# EAGLE design hs-32-spi (EAGLE 9.6.2)
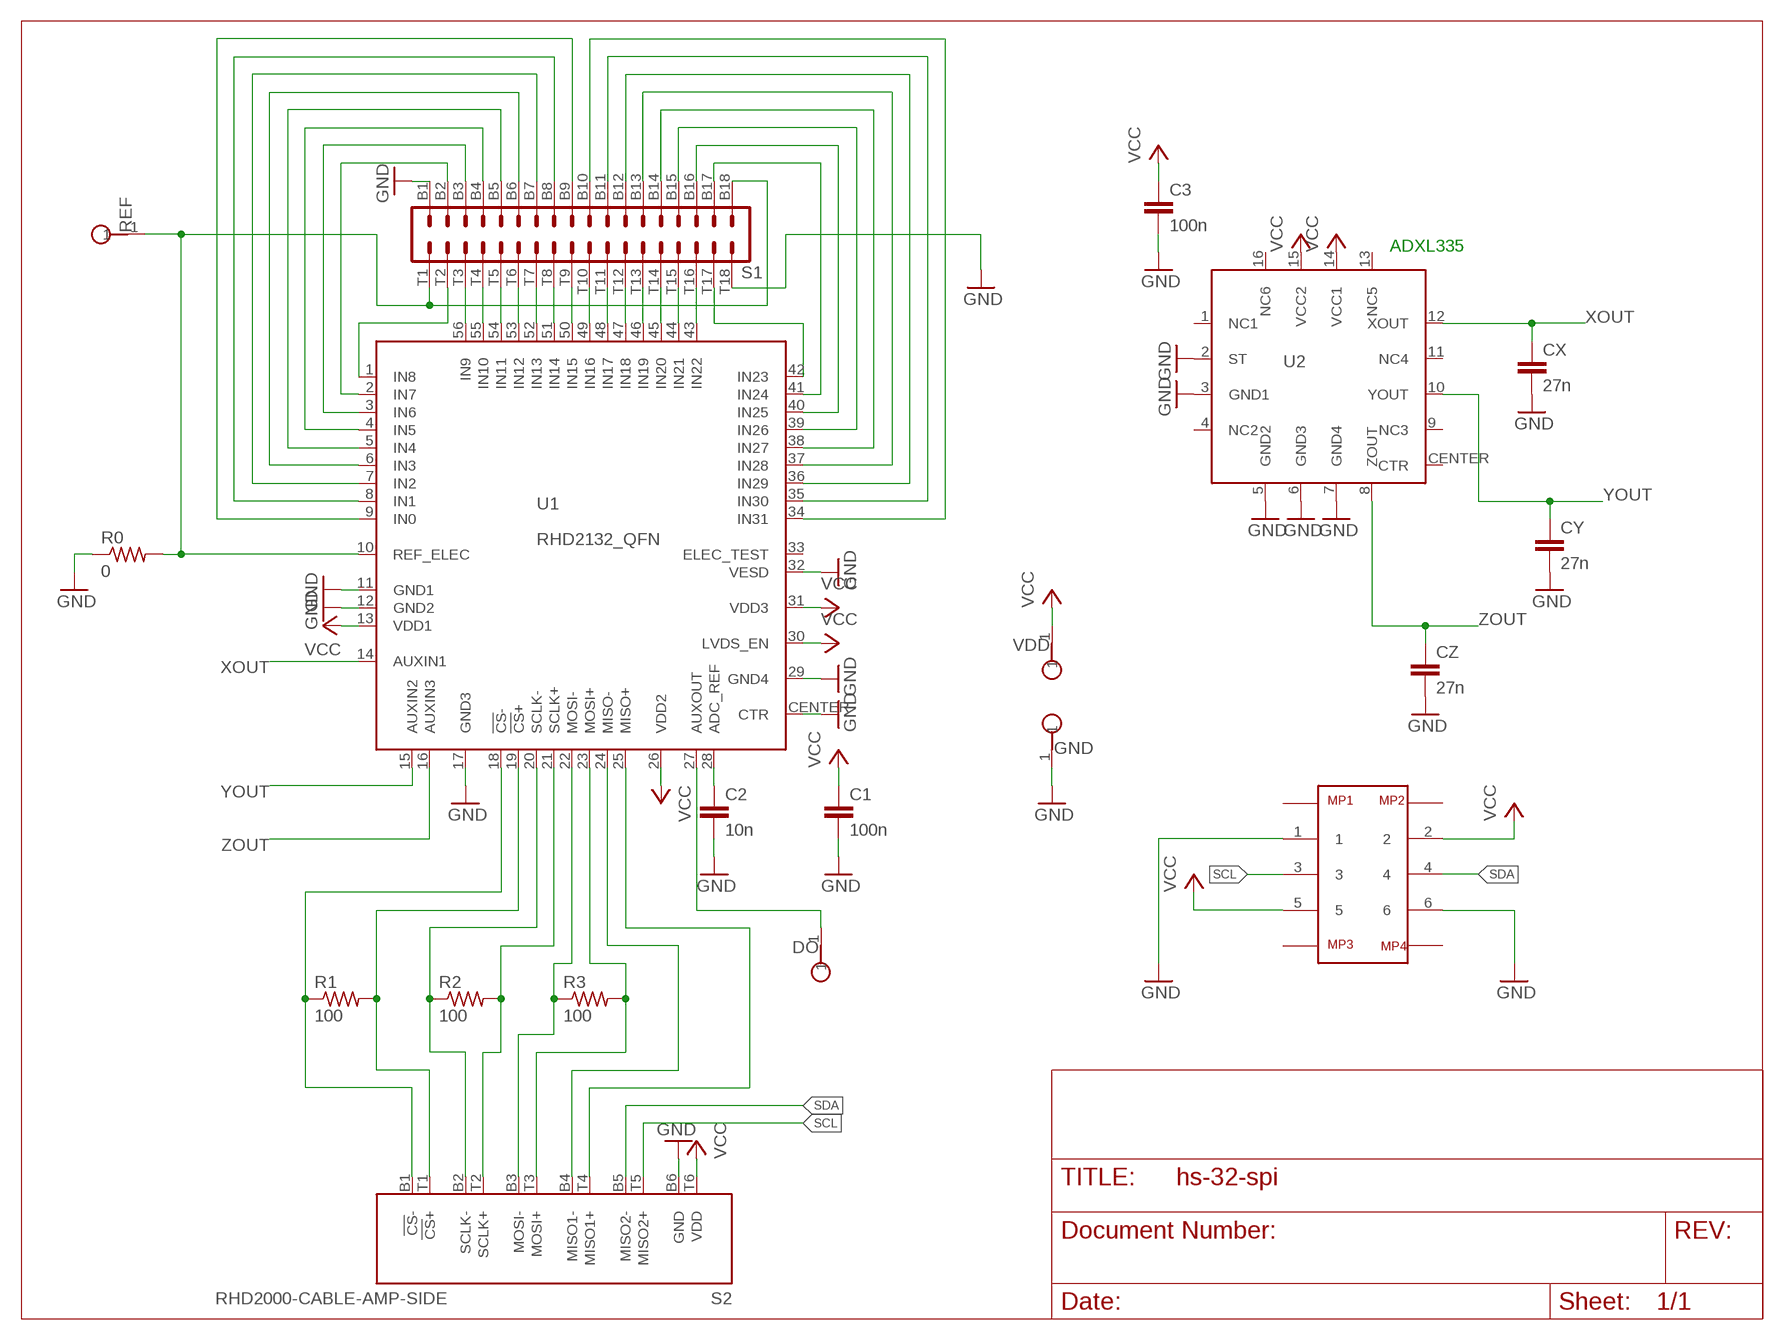
[diagram p0: schematic, sheet 1]

## Parts
C1  100n  C_0402  [0402]
C2  10n  C_0402  [0402]
C3  100n  C_0402  [0402]
CX  27n  C_0402  [0402]
CY  27n  C_0402  [0402]
CZ  27n  C_0402  [0402]
DO  TESTPOINT_SMALL  [TESTPOINT_SMALL]
GND  TESTPOINT_SMALL  [TESTPOINT_SMALL]
R0  0  R_0402  [0402]
R1  100  R_0201  [0201]
R2  100  R_0201  [0201]
R3  100  R_0201  [0201]
REF  TESTPOINT_SMALL  [TESTPOINT_SMALL]
S1  OMNETICS_A79025  [OMNETICS_A79025]
S2  RHD2000-CABLE-AMP-SIDE  [OMNETICS_PZN-12-AA]
U1  RHD2132_QFN  [QFN56_8_X_8_LARGE]
U2  ADXL335  [ADXL335]
U3  MOLEX_5050700622  [MOLEX_5050700622]
VDD  TESTPOINT_SMALL  [TESTPOINT_SMALL]

## Nets
GND: C1.2 C2.2 C3.2 CX.2 CY.2 CZ.2 GND.1 R0.1 S1.B1 S1.T18 S2.B6(GND) U1.11(GND1) U1.12(GND2) U1.17(GND3) U1.29(GND4) U1.32(VESD) U1.CENTER(CTR) U2.2(ST) U2.3(GND1) U2.5(GND2) U2.6(GND3) U2.7(GND4) U3.1 U3.6
N$1: R0.2 REF.1 S1.B18 S1.T1 U1.10(REF_ELEC)
N$2: S1.B3 U1.3(IN6)
N$3: S1.B2 U1.2(IN7)
N$4: S1.B4 U1.4(IN5)
N$5: S1.B5 U1.5(IN4)
N$6: S1.B6 U1.6(IN3)
N$7: S1.B7 U1.7(IN2)
N$8: S1.B8 U1.8(IN1)
N$9: S1.B9 U1.9(IN0)
N$10: S1.B10 U1.34(IN31)
N$11: R1.1 S2.B1(!CS!-) U1.18(!CS!-)
N$12: S1.B17 U1.41(IN24)
N$13: S1.B16 U1.40(IN25)
N$14: S1.B15 U1.39(IN26)
N$15: S1.B14 U1.38(IN27)
N$16: S1.B13 U1.37(IN28)
N$17: S1.B12 U1.36(IN29)
N$18: S1.B11 U1.35(IN30)
N$19: S1.T9 U1.50(IN15)
N$20: S1.T8 U1.51(IN14)
N$21: S1.T7 U1.52(IN13)
N$22: S1.T3 U1.56(IN9)
N$23: S1.T4 U1.55(IN10)
N$24: S1.T5 U1.54(IN11)
N$25: S1.T6 U1.53(IN12)
N$26: S1.T10 U1.49(IN16)
N$27: S1.T11 U1.48(IN17)
N$28: S1.T12 U1.47(IN18)
N$29: S1.T13 U1.46(IN19)
N$30: S1.T14 U1.45(IN20)
N$31: S1.T15 U1.44(IN21)
N$32: S1.T16 U1.43(IN22)
N$33: S1.T2 U1.1(IN8)
N$34: S1.T17 U1.42(IN23)
N$35: R1.2 S2.T1(!CS!+) U1.19(!CS!+)
N$36: R2.1 S2.B2(SCLK-) U1.20(SCLK-)
N$37: R2.2 S2.T2(SCLK+) U1.21(SCLK+)
N$38: R3.1 S2.B3(MOSI-) U1.22(MOSI-)
N$39: R3.2 S2.T3(MOSI+) U1.23(MOSI+)
N$40: S2.B4(MISO1-) U1.24(MISO-)
N$41: S2.T4(MISO1+) U1.25(MISO+)
N$42: C2.1 U1.28(ADC_REF)
N$43: DO.1 U1.27(AUXOUT)
SCL: S2.T5(MISO2+) U3.3
SDA: S2.B5(MISO2-) U3.4
VCC: C1.1 C3.1 S2.T6(VDD) U1.13(VDD1) U1.26(VDD2) U1.30(LVDS_EN) U1.31(VDD3) U2.14(VCC1) U2.15(VCC2) U3.2 U3.5 VDD.1
XOUT: CX.1 U1.14(AUXIN1) U2.12(XOUT)
YOUT: CY.1 U1.15(AUXIN2) U2.10(YOUT)
ZOUT: CZ.1 U1.16(AUXIN3) U2.8(ZOUT)
Unconnected: U1.33(ELEC_TEST) U2.1(NC1) U2.4(NC2) U2.9(NC3) U2.11(NC4) U2.13(NC5) U2.16(NC6) U2.CENTER(CTR) U3.MP1 U3.MP2 U3.MP3 U3.MP4

## Notes on the sheet
- ADXL335

## Library data of the parts
C1-C3 CX CY CZ = RHD2000_eval_board:C: Capacitor
DO GND REF VDD = RHD2000_eval_board:TESTPOINT: PCB Test Point
R0 R1-R3 = RHD2000_eval_board:R: Resistor
S1 = RHD2000:OMNETICS_A79025
S2 = RHD2000:RHD2000-CABLE-AMP-SIDE
U1 = RHD2000:RHD2132
U2 = harrison:ADXL335
U3 = Molex 5050700622:MOLEX_5050700622: Molex 5050700622

## Net classes
1 thick: width 1.016 mm
2 power: width 0.61 mm

## Board
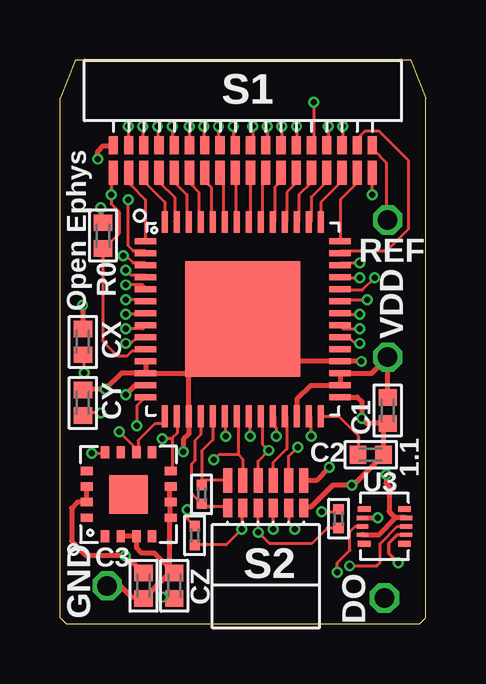
[diagram p1: board, top side]
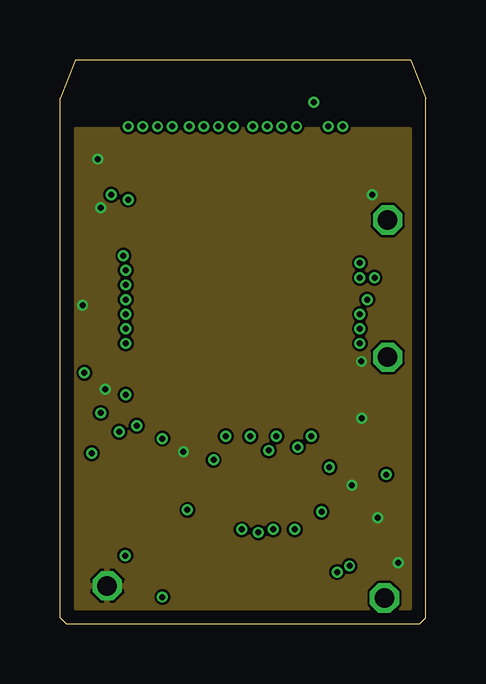
[diagram p2: board, inner layer Route2]
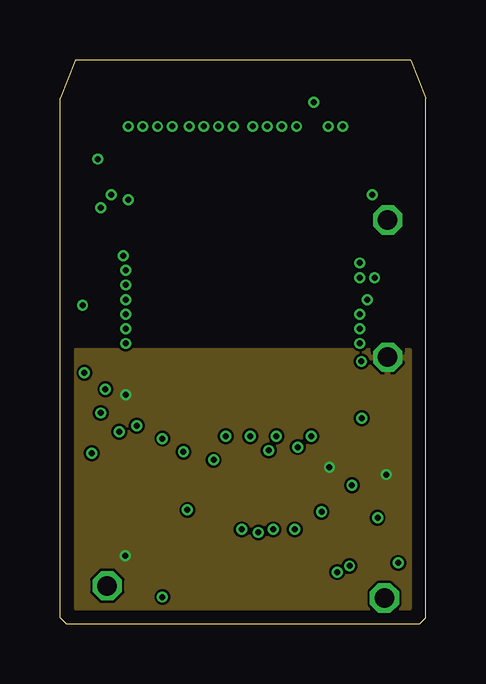
[diagram p3: board, inner layer Route3]
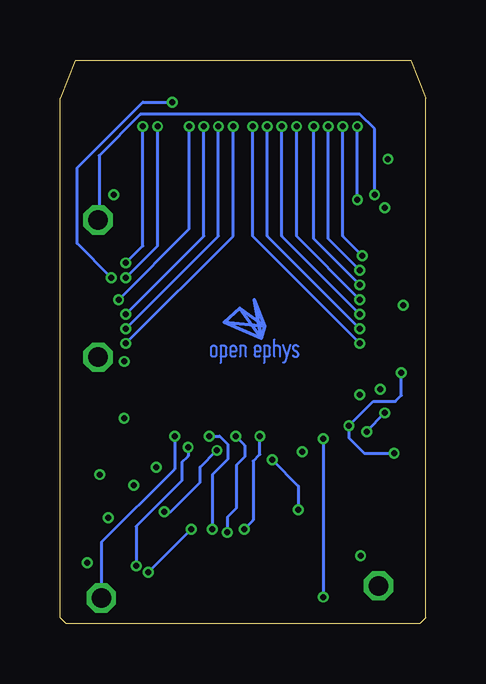
[diagram p4: board, bottom side, seen from below]

Size 15.24 x 23.5 mm. Coordinates in mm from the lower left corner, seen from the top.
Outline: 0,0.25 0,21.91 0.64,23.5 14.61,23.5 15.24,21.91 15.24,0.25 14.99,0 0.25,0 0,0.25
Copper layers (1*2+3*16): Top 0.035mm / dielectric 0.2mm / Route2 0.0175mm / dielectric 0.3mm / Route3 0.035mm / dielectric 0.2mm / Bottom 0.035mm
Design rules "seeed-studio-4-layer": minimum track width 0.09mm, minimum drill 0.2mm, track to track 4mil, track to pad 4mil, pad to pad 4mil, via to via 4mil, smd to smd 0mil, copper to edge 0.1mm, drill to drill 10mil, minimum pad ring 6mil, minimum via ring 4mil, stop-mask expansion 1mil, vias tented up to drill 100mil, thermal gap 0.1mm

### Footprints (pad centres in the part's own frame; a part is rotated, then mirrored left to right if it is on the bottom)
0402 = smd 0.686 x 0.762: 1 -0.533,0; 2 0.533,0
TESTPOINT_SMALL = drill 0.813 octagon: 1 0,0
0201 = smd 0.432 x 0.432: 1 -0.394,0; 2 0.394,0
OMNETICS_A79025 = smd 0.381 x 0.762: B1 -5.397,-1.016; B2 -4.763,-1.016; B3 -4.128,-1.016; B4 -3.493,-1.016; B5 -2.857,-1.016; B6 -2.223,-1.016; B7 -1.587,-1.016; B8 -0.953,-1.016; B9 -0.318,-1.016; B10 0.318,-1.016; B11 0.953,-1.016; B12 1.587,-1.016; B13 2.223,-1.016; B14 2.857,-1.016; B15 3.493,-1.016; B16 4.128,-1.016; B17 4.763,-1.016; B18 5.397,-1.016 | smd 0.381 x 1.016: T1 -5.397,-2.159; T2 -4.763,-2.159; T3 -4.128,-2.159; T4 -3.493,-2.159; T5 -2.857,-2.159; T6 -2.223,-2.159; T7 -1.587,-2.159; T8 -0.953,-2.159; T9 -0.318,-2.159; T10 0.318,-2.159; T11 0.953,-2.159; T12 1.587,-2.159; T13 2.223,-2.159; T14 2.857,-2.159; T15 3.493,-2.159; T16 4.128,-2.159; T17 4.763,-2.159; T18 5.397,-2.159
OMNETICS_PZN-12-AA = smd 0.381 x 0.762: B1 1.587,-1.016; B2 0.953,-1.016; B3 0.318,-1.016; B4 -0.318,-1.016; B5 -0.953,-1.016; B6 -1.587,-1.016 | smd 0.381 x 1.016: T1 1.587,-2.159; T2 0.953,-2.159; T3 0.318,-2.159; T4 -0.318,-2.159; T5 -0.953,-2.159; T6 -1.587,-2.159
QFN56_8_X_8_LARGE = smd 0.9 x 0.25: 1 -4.05,3.25; 2 -4.05,2.75; 3 -4.05,2.25; 4 -4.05,1.75; 5 -4.05,1.25; 6 -4.05,0.75; 7 -4.05,0.25; 8 -4.05,-0.25; 9 -4.05,-0.75; 10 -4.05,-1.25; 11 -4.05,-1.75; 12 -4.05,-2.25; 13 -4.05,-2.75; 14 -4.05,-3.25; 29 4.05,-3.25; 30 4.05,-2.75; 31 4.05,-2.25; 32 4.05,-1.75; 33 4.05,-1.25; 34 4.05,-0.75; 35 4.05,-0.25; 36 4.05,0.25; 37 4.05,0.75; 38 4.05,1.25; 39 4.05,1.75; 40 4.05,2.25; 41 4.05,2.75; 42 4.05,3.25 | smd 0.25 x 0.9: 15 -3.25,-4.05; 16 -2.75,-4.05; 17 -2.25,-4.05; 18 -1.75,-4.05; 19 -1.25,-4.05; 20 -0.75,-4.05; 21 -0.25,-4.05; 22 0.25,-4.05; 23 0.75,-4.05; 24 1.25,-4.05; 25 1.75,-4.05; 26 2.25,-4.05; 27 2.75,-4.05; 28 3.25,-4.05; 43 3.25,4.05; 44 2.75,4.05; 45 2.25,4.05; 46 1.75,4.05; 47 1.25,4.05; 48 0.75,4.05; 49 0.25,4.05; 50 -0.25,4.05; 51 -0.75,4.05; 52 -1.25,4.05; 53 -1.75,4.05; 54 -2.25,4.05; 55 -2.75,4.05; 56 -3.25,4.05 | smd 4.8 x 4.8: CENTER 0,0
ADXL335 = smd 0.5 x 0.35: 1 -1.75,0.975; 2 -1.75,0.325; 3 -1.75,-0.325; 4 -1.75,-0.975; 9 1.75,-0.975; 10 1.75,-0.325; 11 1.75,0.325; 12 1.75,0.975 | smd 0.35 x 0.5: 5 -0.975,-1.75; 6 -0.325,-1.75; 7 0.325,-1.75; 8 0.975,-1.75; 13 0.975,1.75; 14 0.325,1.75; 15 -0.325,1.75; 16 -0.975,1.75 | smd 1.6 x 1.6: CENTER 0,0
MOLEX_5050700622 = smd 0.18 x 0.485: 1 -0.35,-0.907; 2 -0.35,0.907; 3 0,-0.907; 4 0,0.907; 5 0.35,-0.907; 6 0.35,0.907 | smd 0.23 x 0.535: MP1 -0.725,-0.835; MP2 -0.725,0.835; MP3 0.725,-0.835; MP4 0.725,0.835

### Placement (x,y rotation side)
C1  13.65,8.89 270 top
C2  12.95,7.05 0 top
C3  3.48,1.59 270 top
CX  0.95,11.75 90 top
CY  0.95,9.21 90 top
CZ  4.76,1.59 90 top
DO  13.52,1.08 0 top
GND  1.97,1.59 0 top
R0  1.79,16.18 270 top
R1  5.91,5.4 90 top
R2  5.61,3.68 90 top
R3  11.61,4.38 90 top
REF  13.65,16.83 90 top
S1  7.62,20.95 0 top
S2  8.57,3.81 180 top
U1  7.62,12.7 0 top
U2  2.86,5.4 90 top
U3  13.52,4.06 90 top
VDD  13.65,11.11 0 top
X  OE-LOGO_3.5X2.5  [OE-LOGO-3.5X2.5]  7.3,11.81 0 bottom

### Tracks (layer width: path | path; a pad name or v marks a point on that pad's centre or on a via)
GND  (via drill 0.25)
  Top 0.127: 9.35,10.97 7.81,12.51 U1.CENTER | 11.58,10.97 U1.32 | 2.13,19.91 S1.B1 | 1.02,9.75 CY.2 | CX.2 | 10.21,4.88 S2.B6 | 13.57,7.13 13.72,7.3 | 4.57,4.47 U2.5 4.57,4.37 | 4.57,4.98 U2.6 4.57,5.08 | 4.57,5.69 U2.7 | U2.2 | 3.15,3.66 U2.3 | 4.57,2.13 4.76,2.13 CZ.2 | 3.45,1.12 C3.2 3.49,1.05 | v13.01,17.88 13.01,18.8 S1.T18 | 1.67,16.71 R0.1
  Top 0.152: U3.1 14.05,3.71 13.7,3.37 13.7,2.93 v14.1,2.54
  Top 0.203: 9.35,10.97 11.58,10.97 | 10.21,4.88 10.46,4.88 11.37,5.78 v12.17,5.78 12.21,5.78 13.57,7.13 | 4.57,4.98 4.57,4.47 | 4.57,5.08 4.57,5.69 | 3.15,3.66 U2.2 | 4.57,4.37 4.57,2.13 3.49,1.05 | 3.45,1.12 2.98,1.12 2.52,1.59 GND.1 | U3.6 v13.23,4.41 v13.23,4.42 | v5.14,7.18 5.14,7.68 5.37,7.91 U1.17 5.37,10.54 | CZ.2 3.94,2.95 3.4,2.95 3.19,3.16 U2.3 | 5.37,10.54 5.37,10.7 7.18,12.51 7.81,12.51 | U1.12 5.28,10.45 5.37,10.54 | U1.12 2.56,10.45 v1.89,9.78 1.04,9.78 1.02,9.75 | v1.57,19.37 1.57,19.7 1.79,19.91 2.13,19.91 | v1.7,17.34 1.7,16.75 1.67,16.71 | CX.2 0.94,12.29 v0.94,13.27 | U1.29 12.39,9.45 12.57,9.27 v12.57,8.57 12.79,8.36 13.59,8.36 | C1.2 13.59,8.36 | U1.11 U1.12 | C2.2 13.49,8.26 13.59,8.36 | v12.56,10.94 11.69,10.94 U1.32
  pour Route2: 0.64,0.64 14.61,0.64 14.61,20.64 0.64,20.64
N$1  (via drill 0.25)
  Top 0.127: S1.B18 13.11,19.91 13.11,19.71 13.61,19.2 13.61,16.87 REF.1 | S1.T1 2.13,18.8 v2.13,17.88 2.13,17.5 2.49,17.14 2.49,16.28 2.06,15.85 1.99,15.85 R0.2 1.78,15.62 1.78,11.79 2.39,11.18 2.81,11.18 3.01,11.38 3.56,11.38 U1.10
  Bottom 0.127: v2.13,17.88 2.13,20.62 2.74,21.23 11.89,21.23 13.61,19.51 13.61,16.87 REF.1
N$2  (via drill 0.25)
  Top 0.127: v3.45,20.73 3.45,20.02 S1.B3 | v2.64,15.34 2.74,15.34 3.05,15.04 3.56,15.04 U1.3
  Bottom 0.127: v3.45,20.73 3.45,16.15 v2.64,15.34
N$3  (via drill 0.25)
  Top 0.127: v2.85,20.73 2.85,20.02 S1.B2 | v2.85,17.68 2.85,15.75 3.05,15.54 3.56,15.54 U1.2
  Bottom 0.127: v2.85,17.68 v2.85,20.73
N$4  (via drill 0.25)
  Top 0.127: v4.06,20.73 4.06,20.02 S1.B4 | v2.74,14.73 2.95,14.53 3.56,14.53 U1.4
  Bottom 0.127: v4.06,20.73 4.06,16.05 v2.74,14.73
N$5  (via drill 0.25)
  Top 0.127: v4.67,20.73 4.67,20.02 S1.B5 | v2.74,14.12 3.45,14.12 3.56,14.02 U1.5
  Bottom 0.127: v4.67,20.73 4.67,16.05 v2.74,14.12
N$6  (via drill 0.25)
  Top 0.127: v5.38,20.73 5.38,20.02 S1.B6 | v2.74,13.51 3.56,13.51 U1.6
  Bottom 0.127: v5.38,20.73 5.38,16.15 v2.74,13.51
N$7  (via drill 0.25)
  Top 0.127: v5.99,20.73 5.99,20.02 S1.B7 | v2.74,12.9 3.56,12.9 U1.7
  Bottom 0.127: v5.99,20.73 5.99,16.15 v2.74,12.9
N$8  (via drill 0.25)
  Top 0.127: v6.6,20.73 6.6,20.02 S1.B8 | v2.74,12.29 3.45,12.29 3.56,12.39 U1.8
  Bottom 0.127: v6.6,20.73 6.6,16.15 v2.74,12.29
N$9  (via drill 0.25)
  Top 0.127: v7.21,20.73 7.21,20.02 S1.B9 | v2.74,11.68 2.95,11.68 3.15,11.89 3.56,11.89 U1.9
  Bottom 0.127: v7.21,20.73 7.21,16.15 v2.74,11.68
N$10  (via drill 0.25)
  Top 0.127: v8.03,20.73 8.03,20.02 S1.B10 | v12.5,11.68 12.29,11.68 12.09,11.89 11.68,11.89 U1.34
  Bottom 0.127: v8.03,20.73 8.03,16.15 v12.5,11.68
N$11
  Top 0.127: S2.B1 6.96,4.88 5.94,4.88 R1.1 5.49,5.42 5.49,6.67 5.64,6.82 5.64,7.66 5.87,7.89 U1.18
N$12
  Top 0.127: S1.B17 12.39,20.02 12.39,20.22 12.7,20.52 13.31,20.52 14.53,19.3 14.53,16.46 13.61,15.54 11.68,15.54 U1.41
N$13  (via drill 0.25)
  Top 0.127: v11.79,20.73 11.79,20.02 S1.B16 | v12.5,15.04 11.68,15.04 U1.40
  Bottom 0.127: v11.79,20.73 11.79,15.75 v12.5,15.04
N$14  (via drill 0.25)
  Top 0.127: v11.18,20.73 11.18,20.02 S1.B15 | v12.5,14.43 11.68,14.43 U1.39
  Bottom 0.127: v11.18,20.73 11.18,15.75 v12.5,14.43
N$15  (via drill 0.25)
  Top 0.127: v10.57,21.74 10.57,20.02 S1.B14 | v13.11,14.43 12.6,13.92 11.68,13.92 U1.38
  Bottom 0.127: v10.57,21.74 11.79,21.74 14.53,19 14.53,15.85 v13.11,14.43
N$16  (via drill 0.25)
  Top 0.127: v9.86,20.73 9.86,20.02 S1.B13 | v12.8,13.51 11.68,13.51 U1.37
  Bottom 0.127: v9.86,20.73 9.86,16.46 v12.8,13.51
N$17  (via drill 0.25)
  Top 0.127: v9.25,20.73 9.25,20.02 S1.B12 | v12.5,12.9 11.68,12.9 U1.36
  Bottom 0.127: v9.25,20.73 9.25,16.15 v12.5,12.9
N$18  (via drill 0.25)
  Top 0.127: v8.64,20.73 8.64,20.02 S1.B11 | v12.5,12.29 11.79,12.29 11.68,12.39 U1.35
  Bottom 0.127: v8.64,20.73 8.64,16.15 v12.5,12.29
N$19
  Top 0.127: U1.50 7.32,16.76 7.32,18.8 S1.T9
N$20
  Top 0.127: U1.51 6.81,16.76 6.81,18.69 6.71,18.8 S1.T8
N$21
  Top 0.127: U1.52 6.3,16.76 6.3,18.19 6.1,18.39 6.1,18.8 S1.T7
N$22
  Top 0.127: U1.56 4.37,16.76 4.37,17.58 3.56,18.39 3.56,18.8 S1.T3
N$23
  Top 0.127: U1.55 4.78,16.76 4.78,17.78 4.17,18.39 4.17,18.8 S1.T4
N$24
  Top 0.127: U1.54 5.28,16.76 5.28,17.88 4.78,18.39 4.78,18.8 S1.T5
N$25
  Top 0.127: U1.53 5.79,16.76 5.79,17.98 5.49,18.29 5.49,18.8 S1.T6
N$26
  Top 0.127: U1.49 7.92,16.76 7.92,18.8 S1.T10
N$27
  Top 0.127: U1.48 8.43,16.76 8.43,18.69 8.53,18.8 S1.T11
N$28
  Top 0.127: U1.47 8.94,16.76 8.94,18.19 9.14,18.39 9.14,18.8 S1.T12
N$29
  Top 0.127: U1.46 9.45,16.76 9.45,17.98 9.75,18.29 9.75,18.8 S1.T13
N$30
  Top 0.127: U1.45 9.96,16.76 9.96,17.88 10.46,18.39 10.46,18.8 S1.T14
N$31
  Top 0.127: U1.44 10.46,16.76 10.46,17.78 11.07,18.39 11.07,18.8 S1.T15
N$32
  Top 0.127: U1.43 10.87,16.76 10.87,17.58 11.68,18.39 11.68,18.8 S1.T16
N$33
  Top 0.127: U1.1 3.56,15.95 3.56,17.68 2.95,18.29 2.95,18.8 S1.T2
N$34
  Top 0.127: U1.42 11.68,15.95 11.68,17.68 12.29,18.29 12.29,18.8 S1.T17
N$35
  Top 0.127: S2.T1 6.96,5.99 5.94,5.99 R1.2 5.91,7.21 6.37,7.67 U1.19
N$36  (via drill 0.25)
  Top 0.127: S2.B2 7.57,4.78 v7.57,3.94 6.92,3.29 R2.1 | v6.91,7.82 6.91,8.64 U1.20
  Bottom 0.127: v6.91,7.82 6.91,7.06 7.19,6.78 7.19,4.32 v7.57,3.94
N$37  (via drill 0.25)
  Top 0.127: v5.31,4.75 5.31,4.38 R2.2 | U1.21 7.42,8.64 7.42,7.06 | 7.42,7.06 7.62,6.86 S2.T2 | v6.4,6.83 6.63,7.06 7.42,7.06
  Bottom 0.127: v5.31,4.75 5.31,5.74 v6.4,6.83
N$38  (via drill 0.25)
  Top 0.127: S2.B3 8.27,4.8 v8.27,3.81 8.74,3.34 10.48,3.34 11.13,3.99 R3.1 | v7.92,7.82 7.92,8.64 U1.22
  Bottom 0.127: v7.92,7.82 7.54,7.44 7.54,6.96 7.89,6.62 7.89,4.83 8.27,4.45 v8.27,3.81
N$39  (via drill 0.25)
  Top 0.127: v10.9,4.67 11.59,4.67 R3.2 | U1.23 8.43,8.64 8.43,7.49 v8.7,7.23 8.26,6.78 S2.T3
  Bottom 0.127: v10.9,4.67 10.62,4.67 9.4,5.89 9.4,6.53 v8.7,7.23
N$40  (via drill 0.25)
  Top 0.127: v8.89,3.94 S2.B4 | v9.02,7.82 9.02,8.15 8.94,8.23 8.94,8.64 U1.24
  Bottom 0.127: v9.02,7.82 8.59,7.82 8.26,7.49 8.26,6.86 8.89,6.22 v8.89,3.94
N$41
  Top 0.127: S2.T4 8.89,6.73 9.45,7.29 9.45,8.64 U1.25
N$42
  Top 0.127: U1.28 11.62,8.65 12.42,7.85 C2.1
N$43  (via drill 0.25)
  Top 0.127: v10.46,7.82 10.46,8.64 U1.27
  Bottom 0.127: DO.1 13.52,3.4 10.46,6.45 v10.46,7.82
SCL  (via drill 0.25)
  Top 0.127: v9.91,7.37 9.53,6.99 S2.T5 | v12.06,2.41 13.21,2.41 13.34,2.54 13.34,3.34 14.06,4.06 U3.3
  Bottom 0.127: v9.91,7.37 9.91,6.99 10.16,6.73 10.16,5.97 12.06,4.06 v12.06,2.41
SDA  (via drill 0.25)
  Top 0.127: S2.B5 9.53,4.19 v9.78,3.94 | U3.4 12.29,4.06 12.08,3.85 12.08,3.06 11.56,2.54 v11.56,2.16
  Bottom 0.127: v9.78,3.94 v11.56,2.16
VCC  (via drill 0.25)
  Top 0.127: 1.12,5.69 U2.14 | U1.13 | 11.65,9.93 U1.30 11.68,9.96 | 11.68,10.36 U1.31
  Top 0.203: U1.13 3.14,9.94 v2.74,9.55 | 11.65,9.93 10.44,9.93 9.87,9.36 U1.26 | 11.68,10.36 11.68,9.96 | U3.5 13.98,4.41 | U3.2 12.62,3.7 13.26,3.7 13.98,4.41 | 1.12,5.69 1.12,5.08 U2.15 0.73,5.07 0.48,4.83 0.48,3.45 1.09,2.85 v2.72,2.85 3.44,2.12 C3.1 | U1.31 12.99,10.45 VDD.1 C1.1 | v13.59,6.22 13.59,5.84 13.72,5.71 13.72,4.67 13.98,4.41 | v11.23,6.53 10.67,5.97 S2.T6
  pour Route3: 0.64,0.64 14.61,0.64 14.61,11.43 0.64,11.43
XOUT  (via drill 0.25)
  Top 0.127: v1.32,7.11 1.83,7.11 U2.12 | v3.2,8.26 3.2,9.09 3.56,9.45 U1.14 | v1.02,10.46 1.02,11.18 CX.1
  Bottom 0.127: v1.32,7.11 2.56,7.11 3.2,7.75 v3.2,8.26 2.18,9.27 1.27,9.27 1.02,9.53 v1.02,10.46
YOUT  (via drill 0.25)
  Top 0.127: 3.25,7.21 3.25,7.64 3.96,8.36 4.3,8.36 4.37,8.42 U1.15 | v1.7,8.79 1.07,8.79 CY.1 | 3.25,7.21 v2.46,8 | 3.25,7.21 U2.10
  Bottom 0.127: v2.46,8 2.46,8.03 v1.7,8.79
ZOUT  (via drill 0.25)
  Top 0.127: 4.67,7.72 4.67,7.75 4.88,7.95 U1.16 | 4.67,7.72 4.67,6.4 U2.8 | v4.27,1.12 4.76,1.12 CZ.1 | 4.67,7.72 v4.27,7.72
  Bottom 0.127: v4.27,7.72 v4.27,1.12

### Text on the board
tPlace: Open Ephys | 1.1